# EasyEDA Pro project Watch.eprj

# Schematic Schematic1
Board Name: Board1; Create Date: 2025-10-26; Page Name: P1; Project Name: Watch; Schematic Name: Schematic1; Update Date: 2025-10-26; Company: 嘉立创EDA; Page Size: A4; Version: V1.0
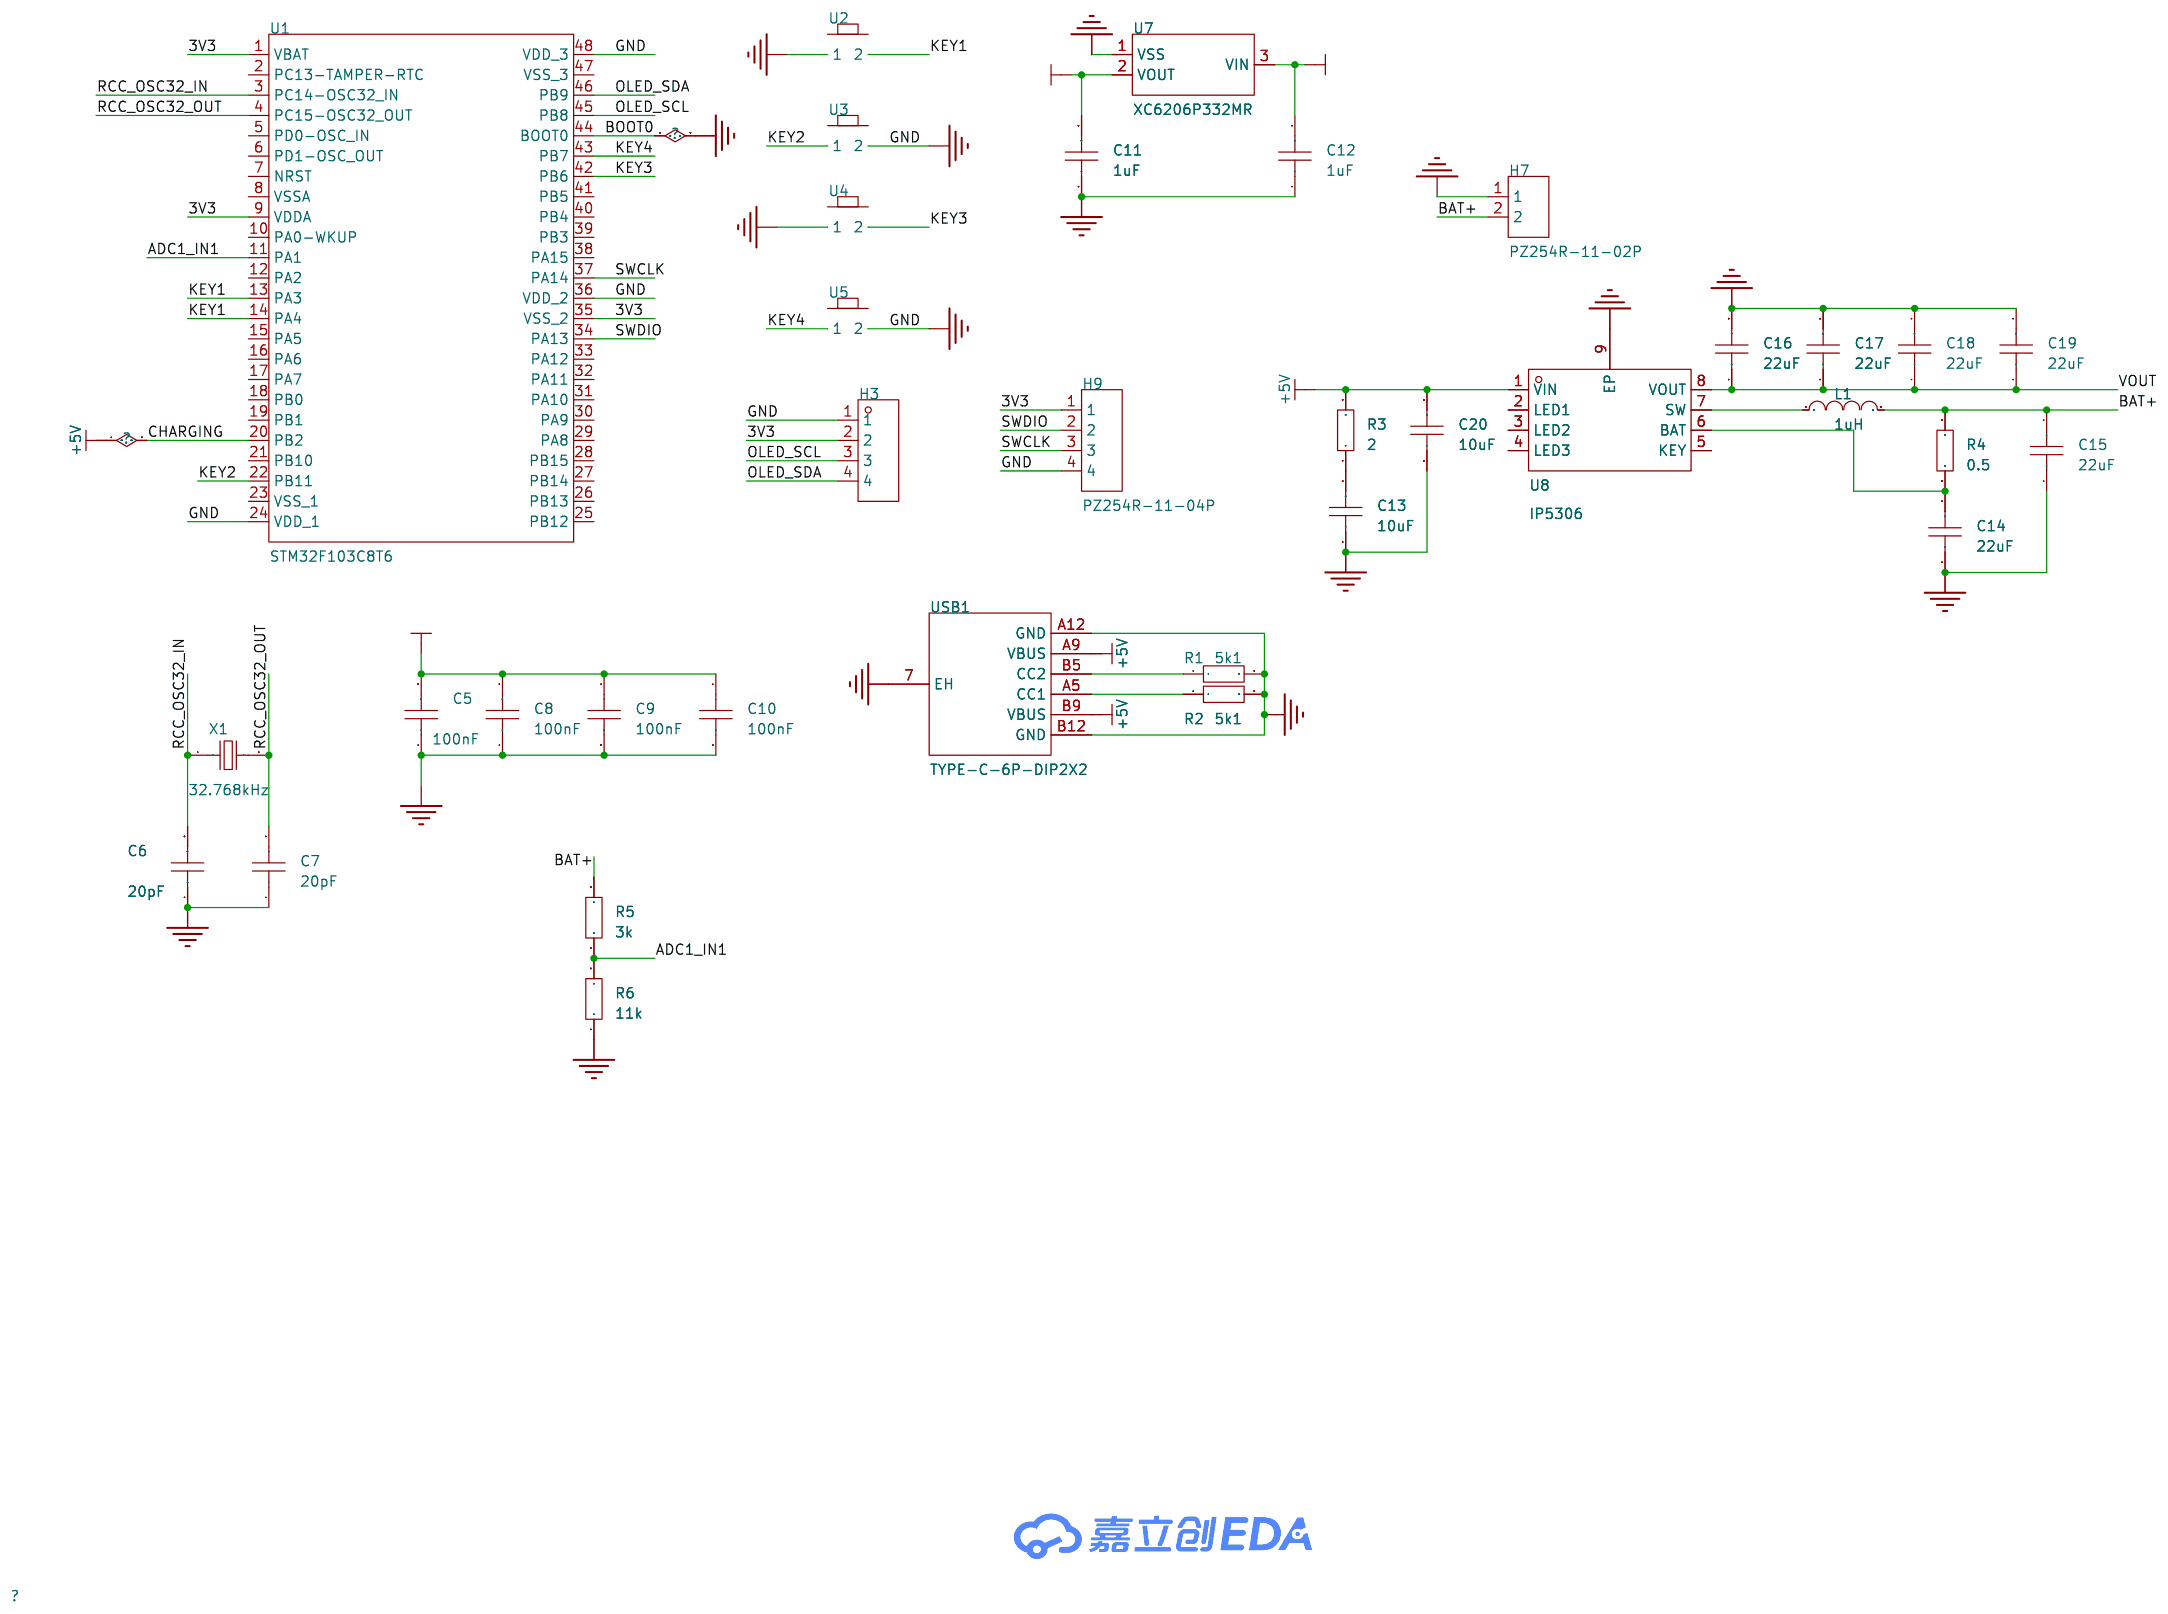
[diagram p0: schematic sheet]

## Parts
C5  100nF  [C0805]
C6  20pF  [C0805]
C7  20pF  [C0805]
C8  100nF  [C0805]
C9  100nF  [C0805]
C10  100nF  [C0805]
C11  1uF  [C0805]
C12  1uF  [C0805]
C13  10uF  [C0805]
C14  22uF  [C0805]
C15  22uF  [C0805]
C16  22uF  [C0805]
C17  22uF  [C0805]
C18  22uF  [C0805]
C19  22uF  [C0805]
C20  10uF  [C0805]
H3  -  [HDR-TH_4P-P2.54-V-F]
H7  PZ254R-11-02P  [HDR-TH_2P-P2.54-H-M-W10.4]
H9  PZ254R-11-04P  [HDR-TH_4P-P2.54-H-M-W10.4]
L1  1uH  [L0805]
R1  5k1  [R0805]
R2  5k1  [R0805]
R3  2  [R0805]
R4  0.5  [R0805]
R5  3k  [R0805]
R6  11k  [R0805]
U1  STM32F103C8T6  [LQFP-48_L7.0-W7.0-P0.50-LS9.0-BL]
U2  -  [侧按按键]
U3  -  [侧按按键]
U4  -  [侧按按键]
U5  -  [侧按按键]
U7  XC6206P332MR  [SOT-23-3_L2.9-W1.6-P1.90-LS2.8-BR]
U8  IP5306  [ESOP-8_L4.9-W3.9-P1.27-LS6.0-BL-EP]
USB1  TYPE-C-6P-DIP2X2  [TYPE-C-SMD_TYPE-C-6P]
X1  32.768kHz  [FC-135R_L3.2-W1.5]

## Library data of the parts
C5-C20 = CAP_0805: Supplier Footprint: 0805
H3 = HDR-F_2.54_1x4P: Supplier Part: C2718488; Supplier Footprint: 插件
H7 = PZ254R-11-02P: LCSC Part Name: 1x2P 间距:2.54mm 方针 弯插; Supplier Part: C492410; Manufacturer: XFCN(兴飞); Supplier Footprint: 弯插,P=2.54mm; JLCPCB Part Class: 扩展库; Datasheet: https://item.szlcsc.com/datasheet/PZ254R-11-02P/502966.html; Supplier: LCSC; Pin Structure: 1x2P; Pitch: 2.54mm; Circluar Pins/Square Pins: 方针; Mounting Type: 弯插; Number of Rows: 单排; Number of Pins: 2P; Length of Mating Pin: 6mm; Insulation Height: 2.5mm; Contact Material: 黄铜; Operating Temperature: -40℃~+105℃; Color: 黑色
H9 = PZ254R-11-04P: LCSC Part Name: 1x4P 间距:2.54mm 方针 弯插; Supplier Part: C492412; Manufacturer: XFCN(兴飞); Supplier Footprint: 弯插,P=2.54mm; JLCPCB Part Class: 扩展库; Datasheet: https://item.szlcsc.com/datasheet/PZ254R-11-04P/502968.html; Supplier: LCSC; Pin Structure: 1x4P; Pitch: 2.54mm; Circluar Pins/Square Pins: 方针; Mounting Type: 弯插; Number of Rows: 单排; Number of Pins: 4P; Length of Mating Pin: 6mm; Insulation Height: 2.5mm; Contact Material: 黄铜; Operating Temperature: -40℃~+105℃; Color: 黑色
L1 = L_0805
R1-R6 = Res_0805: Supplier Footprint: 0805
U1 = STM32F103C8T6: LCSC Part Name: 主流增强型ARM Cortex-M3 MCU，具有64 KB Flash、72 MHz CPU、电机控制、USB和CAN; Supplier Part: C8734; Manufacturer: ST(意法半导体); Supplier Footprint: LQFP-48(7x7); JLCPCB Part Class: 扩展库; Datasheet: https://item.szlcsc.com/datasheet/STM32F103C8T6/9243.html; Supplier: LCSC; CPU Core: ARM-M3; CPU Maximum Speed: 72MHz; Program Storage Size: 64KB; Program Memory Type: FLASH; Number of I/O: 37; ADC (Bit): 12bit; Voltage - Supply: 2V~3.6V
U2-U5 = 侧按按键
U7 = XC6206P332MR: Supplier Part: C2897477; Manufacturer: YONGYUTAI(永裕泰); Supplier Footprint: SOT-23-3L; JLCPCB Part Class: 扩展库; Datasheet: https://item.szlcsc.com/datasheet/XC6206P332MR/3142814.html; Supplier: LCSC; Output Type: 固定; Voltage - Supply: 6V; Output Voltage: 3.3V; Output Current: 250mA; Features: 短路保护；低ESR；过流保护; Operating Temperature: -40℃~+85℃@(Tj); Output Configuration: 正极; Number of Outputs: 1
U8 = IP5306: LCSC Part Name: 集成2.1A充电器和2.1A放电器的全集成移动电源系统级芯片; Supplier Part: C181692; Manufacturer: INJOINIC(英集芯); Supplier Footprint: ESOP-8; JLCPCB Part Class: 扩展库; Datasheet: https://item.szlcsc.com/datasheet/IP5306/193089.html; Supplier: LCSC; The Chip Type: 充电芯片；保护芯片; Voltage - Supply: 4.65V~5.5V; Charge Current - Max: 2.1A; Charging Saturation Voltage: 4.2V; End-Off Voltage: 3V; Type of Battery: 锂电池; Number of Cells: 1; Operating Temperature: 0℃~+70℃; Supply Current (Iq): 100uA; Interface: I2C
USB1 = TYPE-C-6P-DIP2X2: Supplier Part: C9900017627; Supplier Footprint: TYPE-C-6P; JLCPCB Part Class: 扩展库; Supplier: LCSC
X1 = Q13FC13500004_C32346: LCSC Part Name: 32.768kHz ±20ppm 12.5pF; Supplier Part: C32346; Manufacturer: EPSON(爱普生); Manufacturer Part: Q13FC13500004; Supplier Footprint: SMD3215-2P; JLCPCB Part Class: 基础库; Datasheet: https://atta.szlcsc.com/upload/public/pdf/source/20240418/0E0FF5F0356BA3753F616001439D1416.pdf; Supplier: LCSC; Crystal Type: 贴片晶振; Normal temperature Frequency Tolerance: ±20ppm; Load Capacitor: 12.5pF; Equivalent Series Resistance (ESR): 70kΩ; Operating Temperature: -40℃~+85℃

## Nets
3V3: C5.2 C8.2 C9.1 C10.1 C11.2 H3.2 H9.1 U1.1(VBAT) U1.9(VDDA) U1.35(VSS_2) U7.2(VOUT)
+5V: C20.2 R3.2 U1.20(PB2) U8.1(VIN) USB1.A9(VBUS) USB1.B9(VBUS)
GND: C5.1 C6.1 C7.1 C8.1 C9.2 C10.2 C11.1 C12.1 C13.1 C14.1 C15.1 C16.2 C17.2 C18.2 C19.2 C20.1 H3.1 H7.1 H9.4 R1.2 R2.2 R6.1 U1.24(VDD_1) U1.36(VDD_2) U1.44(BOOT0) U1.48(VDD_3) U2.1 U3.2 U4.1 U5.2 U7.1(VSS) U8.9(EP) USB1.7(EH) USB1.A12(GND) USB1.B12(GND)
ADC1_IN1: R5.1 R6.2 U1.11(PA1)
BAT+: C15.2 H7.2 L1.2 R4.2 R5.2
KEY1: U1.13(PA3) U1.14(PA4) U2.2
KEY2: U1.22(PB11) U3.1
KEY3: U1.42(PB6) U4.2
KEY4: U1.43(PB7) U5.1
OLED_SCL: H3.3 U1.45(PB8)
OLED_SDA: H3.4 U1.46(PB9)
RCC_OSC32_IN: C6.2 U1.3(PC14-OSC32_IN) X1.1
RCC_OSC32_OUT: C7.2 U1.4(PC15-OSC32_OUT) X1.2
SWCLK: H9.3 U1.37(PA14)
SWDIO: H9.2 U1.34(PA13)
VOUT: C12.2 C16.1 C17.1 C18.1 C19.1 U7.3(VIN) U8.8(VOUT)
$1N2344: R1.1 USB1.B5(CC2)
$1N2349: R2.1 USB1.A5(CC1)
$1N3351: C13.2 R3.1
$1N3480: L1.1 U8.7(SW)
$1N3572: C14.2 R4.1 U8.6(BAT)

Not connected (* = marked no-connect by the designer): U1 2(PC13-TAMPER-RTC) 5(PD0-OSC_IN) 6(PD1-OSC_OUT) 7(NRST) 8(VSSA) 10(PA0-WKUP) 12(PA2) 15(PA5) 16(PA6) 17(PA7) 18(PB0) 19(PB1) 21(PB10) 23(VSS_1) 25(PB12) 26(PB13) 27(PB14) 28(PB15) 29(PA8) 30(PA9) 31(PA10) 32(PA11) 33(PA12) 38(PA15) 39(PB3) 40(PB4) 41(PB5) 47(VSS_3); U8 2(LED1) 3(LED2) 4(LED3) 5(KEY)

# Board PCB1
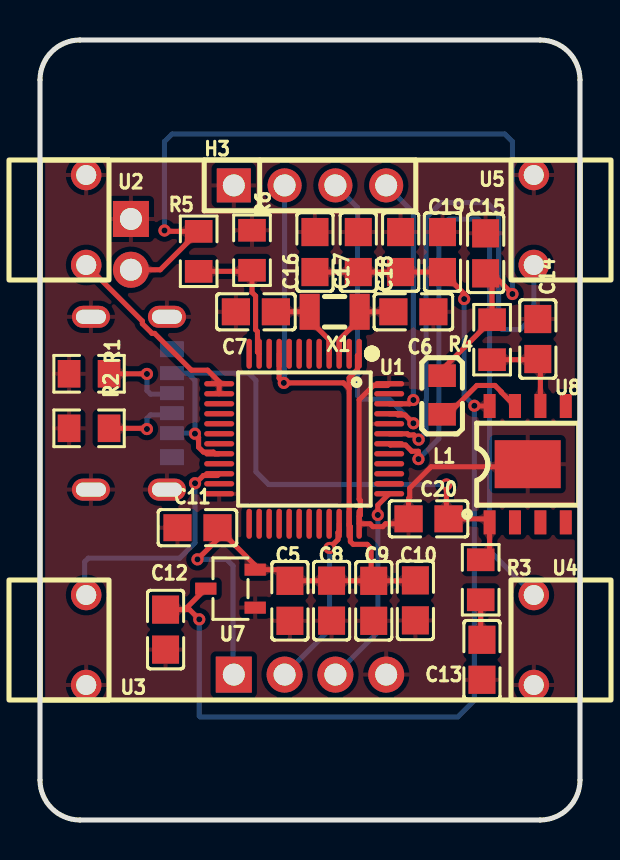
[diagram p1: board, top side]
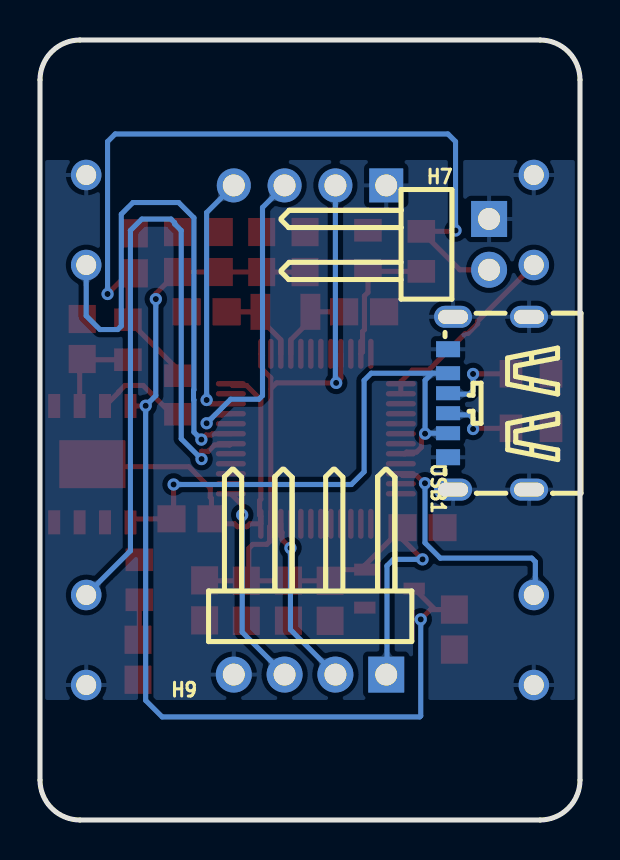
[diagram p2: board, bottom side, seen from below]

Outline 27 x 39 mm; copper layers: Top Layer, Bottom Layer. Coordinates in mm from the lower left corner of the outline.
Outline path: 0,37 0,2 arc(0.59,0.59) 2,0 25,0 arc(26.41,0.59) 27,2 27,37 arc(26.41,38.41) 25,39 2,39 arc(0.59,38.41) 0,37
Stack: Top Layer 0.035mm / Dielectric1 1.51mm FR4 er 4.5 / Bottom Layer 0.035mm

## Design rules (mm)
net RCC_OSC32_IN: DP1
net RCC_OSC32_OUT: DP1
template: JLCPCB Capability(Two Layers Board)
spacing copperThickness1oz (default): track to track 0.102, other pairs 0.152 to 0.3
spacing copperThickness2oz: track to track 0.203, other pairs 0.152 to 0.3
track width copperThickness1oz (default): min 0.127, default 0.254, max 2.54
track width copperThickness2oz: min 0.203, default 0.254, max 2.54
differential pair differentialPair (default): width min 0.127, default 0.254, max 2.54; gap min 0.152, default 0.152
via viaSize (default): diameter min 0.5, default 0.61, max 10; hole min 0.3, default 0.305, max 6.3

## Placement (name value [footprint] x y rotation side)
C5  100nF  [C0805]  12.5 10.96 90 top
C6  20pF  [C0805]  18.67 25.41 180 top
C7  20pF  [C0805]  10.79 25.41 0 top
C8  100nF  [C0805]  14.58 10.97 90 top
C9  100nF  [C0805]  16.69 10.96 270 top
C10  100nF  [C0805]  18.77 10.98 270 top
C11  1uF  [C0805]  7.87 14.62 0 top
C12  1uF  [C0805]  6.28 9.52 90 top
C13  10uF  [C0805]  22.1 8.01 90 top
C14  22uF  [C0805]  24.89 24.05 270 top
C15  22uF  [C0805]  22.28 28.33 270 top
C16  22uF  [C0805]  13.75 28.4 90 top
C17  22uF  [C0805]  15.91 28.4 90 top
C18  22uF  [C0805]  18.03 28.4 90 top
C19  22uF  [C0805]  20.12 28.4 90 top
C20  10uF  [C0805]  19.43 15.06 0 top
H3  -  [HDR-TH_4P-P2.54-V-F]  13.5 31.73 0 top
H7  PZ254R-11-02P  [HDR-TH_2P-P2.54-H-M-W10.4]  4.55 28.78 270 bottom
H9  PZ254R-11-04P  [HDR-TH_4P-P2.54-H-M-W10.4]  13.5 7.27 0 bottom
L1  1uH  [L0805]  20.1 21.25 90 top
R1  5k1  [R0805]  2.45 22.31 180 top
R2  5k1  [R0805]  2.45 19.58 180 top
R3  2  [R0805]  22.03 12.01 90 top
R4  0.5  [R0805]  22.6 24.02 90 top
R5  3k  [R0805]  7.93 28.43 90 top
R6  11k  [R0805]  10.6 28.49 270 top
U1  STM32F103C8T6  [LQFP-48_L7.0-W7.0-P0.50-LS9.0-BL]  13.21 19.06 180 top
U2  -  [侧按按键]  3.45 33 270 top
U3  -  [侧按按键]  3.45 12 270 top
U4  -  [侧按按键]  23.55 6 90 top
U5  -  [侧按按键]  23.55 27 90 top
U7  XC6206P332MR  [SOT-23-3_L2.9-W1.6-P1.90-LS2.8-BR]  9.53 11.57 0 top
U8  IP5306  [ESOP-8_L4.9-W3.9-P1.27-LS6.0-BL-EP]  24.38 17.79 0 top
USB1  TYPE-C-6P-DIP2X2  [TYPE-C-SMD_TYPE-C-6P]  4.57 20.84 90 bottom
X1  32.768kHz  [FC-135R_L3.2-W1.5]  14.73 25.41 180 top

## Footprints (pads in the part's own frame, mm; a bottom-side part is the same pattern mirrored in y, then rotated)
C0805
  rect 1.41x1.35 smd: 1(-1,0) 2(1,0)
ESOP-8_L4.9-W3.9-P1.27-LS6.0-BL-EP
  rect 0.6x1.2 smd: 1(-1.905,-2.909) 2(-0.635,-2.909) 3(0.635,-2.909) 4(1.905,-2.909) 5(1.905,2.909) 6(0.635,2.909) 7(-0.635,2.909) 8(-1.905,2.909)
  rect 3.3x2.4 smd: 9(0,0)
FC-135R_L3.2-W1.5
  rect 1x1.8 smd: 1(-1.25,0) 2(1.25,0)
HDR-TH_2P-P2.54-H-M-W10.4
  rect 1.8x1.8 hole 1.1: 1(-1.27,0)
  round 1.8 hole 1.1: 2(1.27,0)
HDR-TH_4P-P2.54-H-M-W10.4
  rect 1.8x1.8 hole 1.1: 1(-3.81,0)
  round 1.8 hole 1.1: 2(-1.27,0) 3(1.27,0) 4(3.81,0)
HDR-TH_4P-P2.54-V-F
  rect 1.7x1.7 hole 1.1: 1(-3.81,0)
  round 1.7 hole 1.1: 2(-1.27,0) 3(1.27,0) 4(3.81,0)
L0805
  rect 1.133x1.377 smd: 1(-0.966,0) 2(0.966,0)
LQFP-48_L7.0-W7.0-P0.50-LS9.0-BL
  oval 0.27x1.5 smd: 1(-2.75,-4.25) 2(-2.25,-4.25) 3(-1.75,-4.25) 4(-1.25,-4.25) 5(-0.75,-4.25) 6(-0.25,-4.25) 7(0.25,-4.25) 8(0.75,-4.25) 9(1.25,-4.25) 10(1.75,-4.25) 11(2.25,-4.25) 12(2.75,-4.25) 25(2.75,4.25) 26(2.25,4.25) 27(1.75,4.25) 28(1.25,4.25) 29(0.75,4.25) 30(0.25,4.25) 31(-0.25,4.25) 32(-0.75,4.25) 33(-1.25,4.25) 34(-1.75,4.25) 35(-2.25,4.25) 36(-2.75,4.25)
  oval 1.5x0.27 smd: 13(4.25,-2.75) 14(4.25,-2.25) 15(4.25,-1.75) 16(4.25,-1.25) 17(4.25,-0.75) 18(4.25,-0.25) 19(4.25,0.25) 20(4.25,0.75) 21(4.25,1.25) 22(4.25,1.75) 23(4.25,2.25) 24(4.25,2.75) 37(-4.25,2.75) 38(-4.25,2.25) 39(-4.25,1.75) 40(-4.25,1.25) 41(-4.25,0.75) 42(-4.25,0.25) 43(-4.25,-0.25) 44(-4.25,-0.75) 45(-4.25,-1.25) 46(-4.25,-1.75) 47(-4.25,-2.25) 48(-4.25,-2.75)
R0805
  rect 1.133x1.377 smd: 1(-1,0) 2(1,0)
SOT-23-3_L2.9-W1.6-P1.90-LS2.8-BR
  rect 1.07x0.6 smd: 1(1.235,-0.95) 2(1.235,0.95) 3(-1.235,0)
TYPE-C-SMD_TYPE-C-6P
  oval 1.1x1.9 hole 0.7x1.5: 7(-4.32,-2.025) 7(-4.32,1.775) 7(4.32,-2.025) 7(4.32,1.775)
  rect 0.7x1.2 smd: A5(-0.5,2.025) A9(1.5,2.025) B5(0.5,2.025) B9(-1.5,2.025)
  rect 0.8x1.2 smd: A12(2.7,2.025) B12(-2.7,2.025)
侧按按键
  round 1.524 hole 1: 1(0.75,-1.14) 2(5.25,-1.14)

## Nets
As in the schematic.

Pads without a net: U1 2 5 6 7 8 10 12 15 16 17 18 19 21 23 25 26 27 28 29 30 31 32 33 38 39 40 41 47; U8 2 3 4 5

## Via types
v1: diameter 0.61, hole 0.305, Top Layer to Bottom Layer, 18 vias

## Routing (per net, layer and track width the routed paths; a pad name or vN(x,y) marks a point on that pad's centre or on a via; arc(x,y) is an arc through that point)
3V3: length 47.8
  Top Layer w0.254: C9.1 16.56,12.09 16.56,13.58 16.36,13.78 15.66,13.78 15.52,13.92 15.52,14.67 15.46,14.73 U1.35 15.46,21.57 ; C9.1 C5.2 11.94,12.52 U7.2 10.76,12.73 C11.2 8.87,14.03 v1(7.87,13.03) ; C9.1 18.75,11.96 C10.1 ; U1.9 11.96,22.09 v1(12.19,21.86) 15.17,21.86 15.46,21.57 ; 15.46,21.57 15.46,22.11 15.87,22.52 15.87,23.22 U1.1
  Bottom Layer w0.254: H3.2 12.23,21.89 v1(12.19,21.86) ; H9.1 9.65,7.31 9.65,12.71 9.33,13.03 v1(7.87,13.03)
+5V: length 30.9
  Top Layer w0.254: R3.2 22.48,13.45 22.48,14.88 22.3,15.06 C20.2 20.32,15.17 v1(20.32,16.78) ; U1.20 8.75,18.31 8.66,18.4 8.17,18.4 7.93,18.64 7.93,19.13 v1(7.75,19.31)
  Bottom Layer w0.254: USB1.B9 7.72,19.34 v1(7.75,19.31) 7.75,21.98 7.39,22.34 ; USB1.A9 7.39,22.34 ; 7.39,22.34 10.44,22.34 10.79,21.98 10.79,17.41 11.43,16.78 v1(20.32,16.78)
GND: length 18.7
  Top Layer w0.254: U8.9 24.26,17.66 19.56,17.66 18.49,16.59 18.49,16.14 18.43,16.08 C20.1 18.18,14.81 17.28,14.81 17.13,14.67 16.65,14.67 16.5,14.81 U1.36 15.96,15.19 16.02,15.25 16.02,15.98 15.96,16.04 15.96,21.01 16.67,21.72 17.37,21.72 U1.48
ADC1_IN1: length 7
  Top Layer w0.254: R5.1 10.55,27.43 R6.2 10.6,26.38 10.78,26.2 10.78,24.52 10.87,24.42 10.87,23.4 U1.11
BAT+: length 43.7
  Top Layer w0.254: v1(6.22,29.47) 6.26,29.43 R5.2 6.01,27.51 H7.2 ; L1.2 20.1,22.52 R4.2 22.6,27.01 C15.2 22.59,27.33 v1(23.62,26.3)
  Bottom Layer w0.254: v1(23.62,26.3) 23.62,33.92 23.24,34.3 6.6,34.3 6.22,33.92 v1(6.22,29.47)
KEY1: length 9.7
  Top Layer w0.254: U2.2 5.12,24.94 5.12,24.82 5.6,24.33 5.73,24.33 7.57,22.49 8.38,22.49 8.96,21.91 U1.13 U1.14
KEY2: length 12
  Top Layer w0.254: U1.22 8.87,17.22 8.17,17.22 7.78,16.84 v1(7.75,16.84)
  Bottom Layer w0.254: U3.1 2.23,11.33 2.23,12.91 2.41,13.09 6.99,13.09 7.75,13.86 v1(7.75,16.84)
KEY3: length 36
  Top Layer w0.254: U1.42 17.52,18.75 18.27,18.75 18.59,18.44 18.91,18.44 18.92,18.43 v1(18.92,18.05)
  Bottom Layer w0.254: v1(18.92,18.05) 19.94,19.06 19.94,29.47 20.27,29.8 20.27,29.87 20.45,30.05 21.91,30.05 22.48,29.47 22.48,13.46 U4.2
KEY4: length 27.3
  Top Layer w0.254: v1(18.93,19.02) 18.7,19.25 18.43,19.25 18.37,19.31 U1.43
  Bottom Layer w0.254: v1(18.93,19.02) 19.3,19.39 19.3,21 19.32,21.02 19.32,21.49 19.3,21.51 19.3,30.11 20.07,30.87 22.35,30.87 22.93,30.29 22.93,24.7 23.11,24.52 24,24.52 24.69,25.21 U5.1
OLED_SCL: length 15.7
  Top Layer w0.254: v1(18.67,19.84) 18.26,20.25 17.9,20.25 17.83,20.31 U1.45
  Bottom Layer w0.254: v1(18.67,19.84) 17.47,21.04 16.05,21.04 15.88,21.22 15.88,30.62 H3.3
OLED_SDA: length 12.6
  Top Layer w0.254: U1.46 18.48,20.81 v1(18.67,21)
  Bottom Layer w0.254: v1(18.67,21) 18.67,30.37 H3.4
RCC_OSC32_IN: length 4.2
  Top Layer w0.254: U1.3 14.96,24.01 15.98,25.04 X1.1 C6.2
RCC_OSC32_OUT: length 4.2
  Top Layer w0.254: C7.2 X1.2 13.48,24.99 14.46,24.01 U1.4
SWCLK: length 10.2
  Top Layer w0.254: v1(16.89,15.25) 16.89,15.74 U1.37
  Bottom Layer w0.254: v1(16.89,15.25) 16.89,9.39 H9.3
SWDIO: length 8.7
  Top Layer w0.254: v1(14.48,13.6) 14.9,14.02 14.9,14.37 14.96,14.44 U1.34
  Bottom Layer w0.254: H9.2 14.48,9.52 v1(14.48,13.6)
VOUT: length 51.5
  Top Layer w0.254: 22.48,20.7 21.73,20.7 v1(21.72,20.71) ; 7.24,10.52 U7.3 ; 7.24,10.52 7.47,10.52 v1(7.96,10.03) ; 7.24,10.52 C12.2 ; v1(21.21,26.05) 21.21,26.31 C19.1 C18.1 C17.1 C16.1
  Bottom Layer w0.254: v1(21.21,26.05) 21.21,21.22 v1(21.72,20.71) 21.72,5.98 20.89,5.15 8.01,5.15 7.96,5.21 v1(7.96,10.03)
$1N2344: length 4.1
  Top Layer w0.254: R1.1 5.34,22.31 v1(5.35,22.3)
  Bottom Layer w0.254: USB1.B5 6.55,21.29 5.53,21.29 5.35,21.47 v1(5.35,22.3)
$1N2349: length 3.8
  Top Layer w0.254: R2.1 5.31,19.58 v1(5.35,19.55)
  Bottom Layer w0.254: v1(5.35,19.55) 5.35,20.08 5.53,20.26 6.51,20.26 USB1.A5
$1N3351: length 2
  Top Layer w0.254: C13.2 22.03,9.08 R3.1
$1N3480: length 4.7
  Top Layer w0.254: L1.1 20.4,20.28 21.84,21.73 22.75,21.73 23.06,21.42 23.06,21.39 U8.7
$1N3572: length 4.7
  Top Layer w0.254: 25.02,20.7 25.02,22.92 C14.2 24.86,23.02 R4.1

## Copper pours and planes (outline as drawn; the poured copper is in the pictures)
GND on Top Layer: 0,33 27,33 27,6 0,6
GND on Bottom Layer: 0,33 27,33 27,6 0,6

Small or netless copper shapes (teardrops, artwork), in the pictures only: 92 on Top Layer, 34 on Bottom Layer
